# EAGLE design ajile_ximea_trigger_adapter (EAGLE 9.0.1)
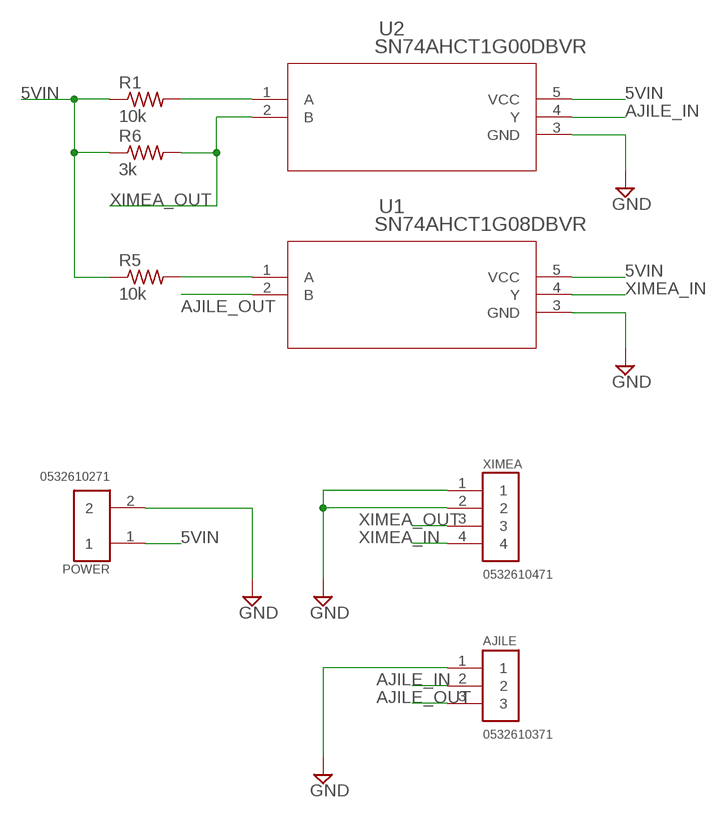
[diagram p0: schematic, sheet 1]

## Parts
AJILE  0532610371  [MOLEX_0532610371]
POWER  0532610271  [MOLEX_0532610271]
R1  10k  R-US_R0603  [R0603]
R5  10k  R-US_R0603  [R0603]
R6  3k  R-US_R0603  [R0603]
U1  SN74AHCT1G08DBVR  [DBV5]
U2  SN74AHCT1G00DBVR  [DBV5]
XIMEA  0532610471  [MOLEX_0532610471]

## Nets
5VIN: POWER.1 R1.1 R5.1 R6.1 U1.5(VCC) U2.5(VCC)
AJILE_IN: AJILE.2 U2.4(Y)
AJILE_OUT: AJILE.3 U1.2(B)
GND: AJILE.1 POWER.2 U1.3(GND) U2.3(GND) XIMEA.1 XIMEA.2
N$4: R1.2 U2.1(A)
N$6: R5.2 U1.1(A)
XIMEA_IN: U1.4(Y) XIMEA.4
XIMEA_OUT: R6.2 U2.2(B) XIMEA.3

## Library data of the parts
AJILE = 0532610371:0532610371: 1.25mm (.049") Pitch PicoBlade Header, Surface Mount, Right Angle, Lead-free, 3 Circuits; DESCRIPTION: 1.25mm _.049_ Pitch PicoBlade Header, Surface Mount, Right Angle, Lead-free, 3 Circuits; DIGI-KEY_PART_NUMBER: WM7621CT-ND; DIGI-KEY_PURCHASE_URL: https://www.digikey.com/product-detail/en/molex-llc/0532610371/WM7621CT-ND/699108?utm_source=snapeda&utm_medium=aggregator&utm_campaign=symbol; MF: Molex, LLC; MP: 0532610371; PACKAGE: None
POWER = 0532610271:0532610271: 1.25mm (.049") Pitch PicoBlade Header, Surface Mount, Right Angle, Lead-free, 2 Circuits; DESCRIPTION: 1.25mm _.049_ Pitch PicoBlade Header, Surface Mount, Right Angle, Lead-free, 2 Circuits; DIGI-KEY_PART_NUMBER: WM7620CT-ND; DIGI-KEY_PURCHASE_URL: https://www.digikey.com/product-detail/en/molex-llc/0532610271/WM7620CT-ND/699107?utm_source=snapeda&utm_medium=aggregator&utm_campaign=symbol; MF: Molex, LLC; MP: 0532610271; PACKAGE: None
R1 R5 R6 = resistor:R-US_: RESISTOR, American symbol
U1 = sn74ahct:SN74AHCT1G08DBVR; MANUFACTURER_PART_NUMBER: SN74AHCT1G08DBVR; VENDOR: Texas Instruments
U2 = sn74ahct1g00:SN74AHCT1G00DBVR; MANUFACTURER_PART_NUMBER: SN74AHCT1G00DBVR; VENDOR: Texas Instruments
XIMEA = 0532610471:0532610471: Conn Shrouded Header HDR 4 POS 1.25mm Solder RA SMD PicoBlade™ Embossed T/R; DESCRIPTION: Conn Shrouded Header HDR 4 POS 1.25mm Solder RA SMD PicoBlade™ Embossed T/R; DIGI-KEY_PART_NUMBER: WM7622CT-ND; DIGI-KEY_PURCHASE_URL: https://www.digikey.com/product-detail/en/molex-llc/0532610471/WM7622CT-ND/699109?utm_source=snapeda&utm_medium=aggregator&utm_campaign=symbol; MF: Molex, LLC; MP: 0532610471; PACKAGE: None

## Board
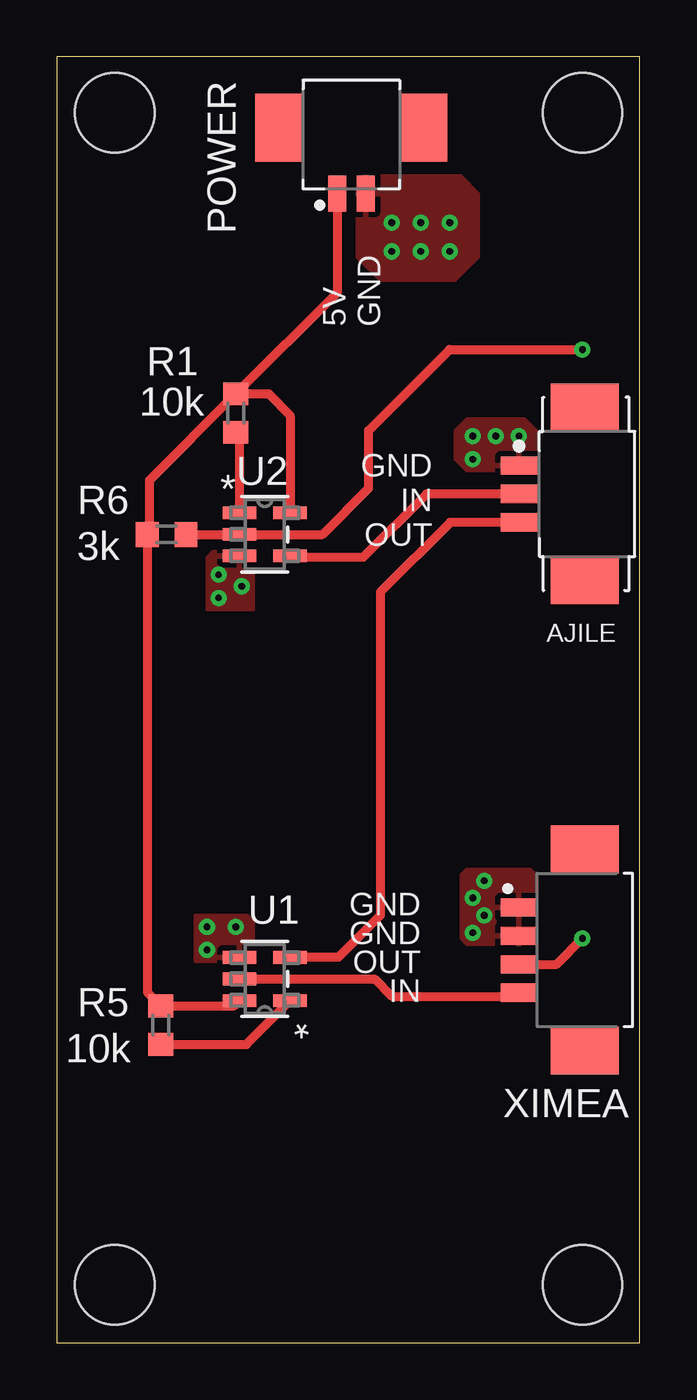
[diagram p1: board, top side]
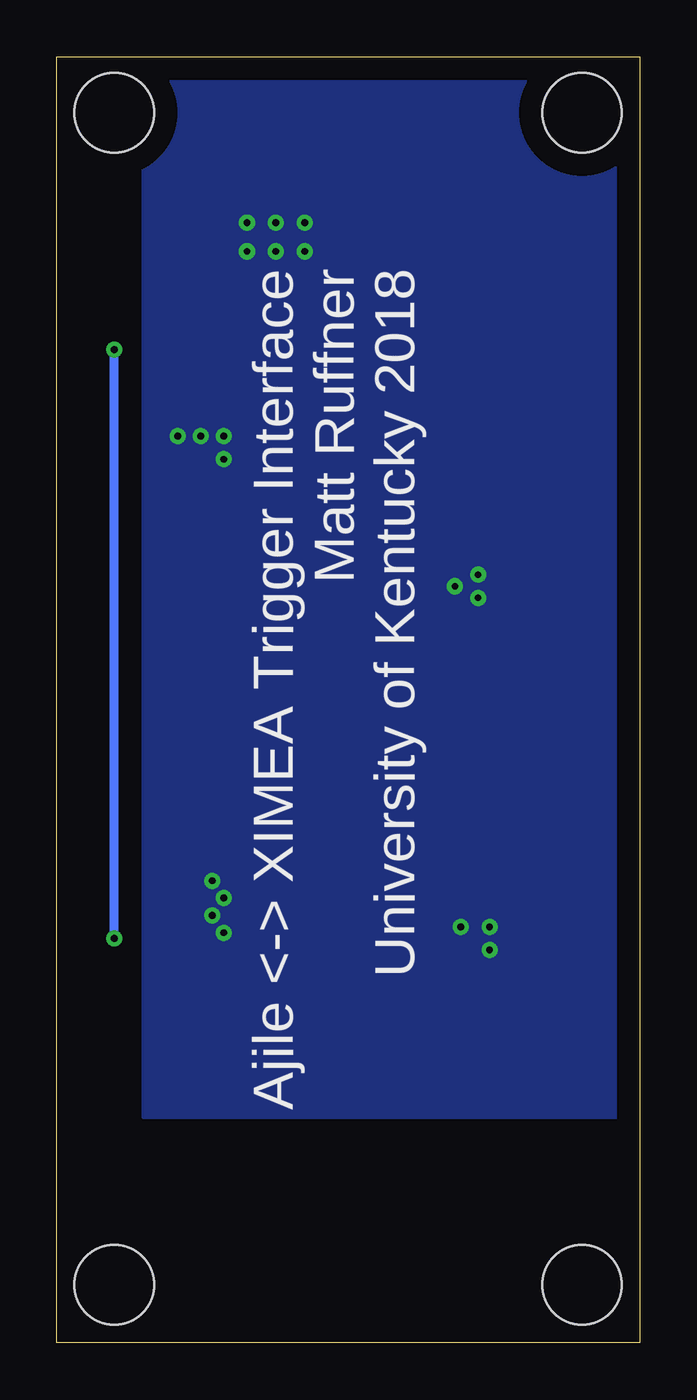
[diagram p2: board, bottom side, seen from below]

Size 25.63 x 56.57 mm. Coordinates in mm from the lower left corner, seen from the top.
Outline: 0,0 25.63,0 25.63,56.57 0,56.57 0,0
Copper layers (1*16): Top 0.035mm / dielectric 1.5mm / Bottom 0.035mm
Design rules "default *": minimum track width 6mil, minimum drill 0.35mm, track to track 6mil, track to pad 6mil, pad to pad 6mil, via to via 6mil, smd to smd 6mil, copper to edge 40mil, drill to drill 6mil, minimum pad ring 10mil, minimum via ring 8mil, stop-mask expansion 4mil, vias tented up to drill 0.3mm, thermal gap 10mil
Holes 3.5 mm at 2.54,2.54 23.11,2.54 2.54,54.1 23.11,54.1

### Footprints (pad centres in the part's own frame; a part is rotated, then mirrored left to right if it is on the bottom)
MOLEX_0532610371 = smd 0.8 x 1.6: 1 1.25,0; 2 0,0; 3 -1.25,0 | smd 2.1 x 3: 4 -3.8,-2.9; 5 3.8,-2.9
MOLEX_0532610271 = smd 0.8 x 1.6: 1 0.625,0; 2 -0.625,0 | smd 2.1 x 3: 3 -3.175,-2.9; 4 3.175,-2.9
R0603 = smd 1 x 1.1: 1 -0.85,0; 2 0.85,0
DBV5 = smd 1.473 x 0.559: 1 -1.118,0.95; 2 -1.118,-0.95; 3 1.118,-0.95; 4 1.118,0; 5 1.118,0.95
DBV5' = smd 1.473 x 0.559: 1 -1.118,0.95; 2 -1.118,0; 3 -1.118,-0.95; 4 1.118,-0.95; 5 1.118,0.95
MOLEX_0532610471 = smd 0.8 x 1.6: 1 1.875,0; 2 0.625,0; 3 -0.625,0; 4 -1.875,0 | smd 2.1 x 3: 5 -4.425,-2.9; 6 4.425,-2.9

### Placement (x,y rotation side)
AJILE  20.32,37.34 90 top
POWER  12.95,50.55 180 top
R1  7.87,40.89 270 top
R5  4.57,13.97 270 top
R6  4.83,35.56 0 top
U1  9.14,16 180 top
U2  SN74AHCT1G00DBVR  [DBV5']  9.14,35.56 0 top
XIMEA  20.32,17.27 90 top

### Tracks (layer width: path | path; a pad name or v marks a point on that pad's centre or on a via)
5VIN
  Top 0.406: POWER.1 12.33,46.2 R1.1 | R1.1 4.06,37.93 4.06,35.65 R6.1 3.98,15.42 R5.1 7.79,14.82 U1.5 | R1.1 9.31,41.74 10.26,40.79 U2.5
AJILE_IN
  Top 0.406: AJILE.2 16.26,37.34 13.46,34.54 10.33,34.54 U2.4
AJILE_OUT
  Top 0.406: AJILE.3 17.29,36.09 14.22,33.02 14.22,18.8 12.38,16.95 U1.2
GND  (via drill 0.3)
  other vias: 14.73,49.28 16,49.28 17.27,49.28 17.27,48.01 16,48.01 14.73,48.01 18.29,38.86 18.29,39.88 19.3,39.88 20.32,39.88 7.11,33.78 8.13,33.27 7.11,32.77 7.87,18.29 6.6,17.27 6.6,18.29 18.8,20.32 18.29,19.56 18.8,18.8 18.29,18.03
  pour Bottom (isolate 0.508): -1.78,57.66 21.84,57.66 21.84,9.91 -1.78,9.91
  pour Top: 13.21,51.31 13.21,47.75 14.22,46.74 17.53,46.74 18.54,47.75 18.54,50.55 17.78,51.31
  pour Top: 20.83,38.35 18.03,38.35 17.53,38.86 17.53,40.13 18.03,40.64 20.57,40.64 21.08,40.13 21.08,38.61
  pour Top: 8.64,34.8 6.86,34.8 6.6,34.54 6.6,32.26 8.64,32.26
  pour Top: 8.64,16.76 8.64,18.54 8.38,18.8 6.1,18.8 6.1,16.76
  pour Top: 21.08,17.53 18.03,17.53 17.78,17.78 17.78,20.57 18.03,20.83 20.83,20.83 21.08,20.57
N$4
  Top 0.406: R1.2 8.03,39.89 U2.1
N$6
  Top 0.406: R5.2 8.33,13.12 U1.1
XIMEA_IN
  Top 0.406: U1.4 13.97,16 14.73,15.24 20.16,15.24 XIMEA.4
XIMEA_OUT  (via drill 0.3)
  Top 0.406: R6.2 U2.2 11.68,35.56 13.72,37.59 13.72,40.13 17.27,43.69 v23.11,43.69 | v23.11,17.78 21.98,16.65 XIMEA.3
  Bottom 0.406: v23.11,17.78 v23.11,43.69

### Text on the board
tNames: 5V | GND | GND | IN | OUT | GND | GND | OUT | IN
bNames: Ajile <-> XIMEA Trigger Interface / Matt Ruffner / University of Kentucky 2018